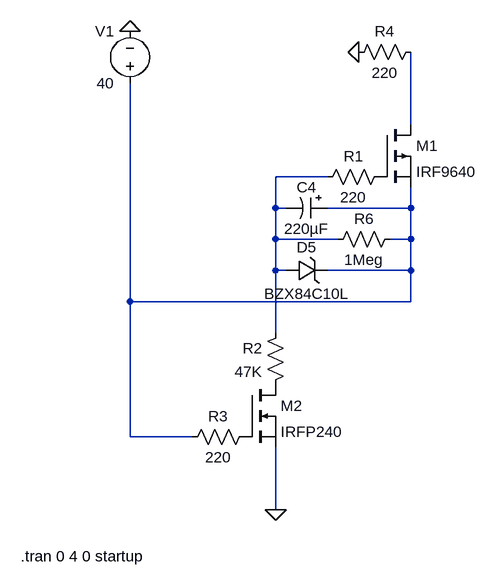
[diagram p0: schematic SoftStart.asc]
SoftStart.asc, the LTspice schematic file:
Version 4
SHEET 1 1072 680
WIRE 544 -80 544 -192
WIRE 416 0 336 0
WIRE 336 48 336 0
WIRE 352 48 336 48
WIRE 544 48 544 16
WIRE 544 48 416 48
WIRE 336 96 336 48
WIRE 432 96 336 96
WIRE 544 96 544 48
WIRE 544 96 512 96
WIRE 336 144 336 96
WIRE 352 144 336 144
WIRE 544 144 544 96
WIRE 544 144 416 144
WIRE 112 192 112 -144
WIRE 544 192 544 144
WIRE 544 192 112 192
WIRE 336 240 336 144
WIRE 112 400 112 192
WIRE 208 400 112 400
WIRE 336 512 336 416
FLAG 112 -224 0
FLAG 464 -192 0
FLAG 336 512 0
SYMBOL voltage 112 -128 R180
WINDOW 0 24 96 Left 2
WINDOW 3 24 16 Left 2
WINDOW 123 0 0 Left 2
WINDOW 39 0 0 Left 2
SYMATTR InstName V1
SYMATTR Value 40
SYMBOL res 560 -208 R90
WINDOW 0 0 56 VBottom 2
WINDOW 3 32 56 VTop 2
SYMATTR InstName R4
SYMATTR Value 220
SYMBOL nmos 288 320 R0
SYMATTR InstName M2
SYMATTR Value IRFP240
SYMBOL polcap 416 32 R90
WINDOW 3 32 32 VTop 2
WINDOW 0 0 32 VBottom 2
SYMATTR Value 220µF
SYMATTR InstName C4
SYMATTR Description Capacitor
SYMATTR Type cap
SYMATTR SpiceLine V=4 Irms=1 Rser=0.07 Lser=0
SYMBOL zener 352 160 R270
WINDOW 0 36 32 VTop 2
WINDOW 3 -4 32 VBottom 2
SYMATTR InstName D5
SYMATTR Value BZX84C10L
SYMBOL res 512 -16 R90
WINDOW 0 0 56 VBottom 2
WINDOW 3 32 56 VTop 2
SYMATTR InstName R1
SYMATTR Value 220
SYMBOL res 528 80 R90
WINDOW 0 0 56 VBottom 2
WINDOW 3 32 56 VTop 2
SYMATTR InstName R6
SYMATTR Value 1Meg
SYMBOL res 352 224 M0
SYMATTR InstName R2
SYMATTR Value 47K
SYMBOL pmos 496 -80 R0
SYMATTR InstName M1
SYMATTR Value IRF9640
SYMBOL res 304 384 R90
WINDOW 0 0 56 VBottom 2
WINDOW 3 32 56 VTop 2
SYMATTR InstName R3
SYMATTR Value 220
TEXT -56 584 Left 2 !.tran 0 4 0 startup

The netlist it stands for:
* SoftStart.asc
V1 N003 0 40
R4 N001 0 220
M2 P001 P002 0 0 IRFP240
C4 N003 N002 220µF V=4 Irms=1 Rser=0.07 Lser=0
D5 N002 N003 BZX84C10L
R1 P003 N002 220
R6 N003 N002 1Meg
R2 N002 P001 47K
M1 N001 P003 N003 N003 IRF9640
R3 P002 N003 220
.model D D
.lib standard.dio
.model NMOS NMOS
.model PMOS PMOS
.lib standard.mos
.tran 0 4 0 startup
.backanno
.end